# Altium schematic sheet LaserDiode.SchDoc
size B; SheetNumber: 5; SheetTotal: 6
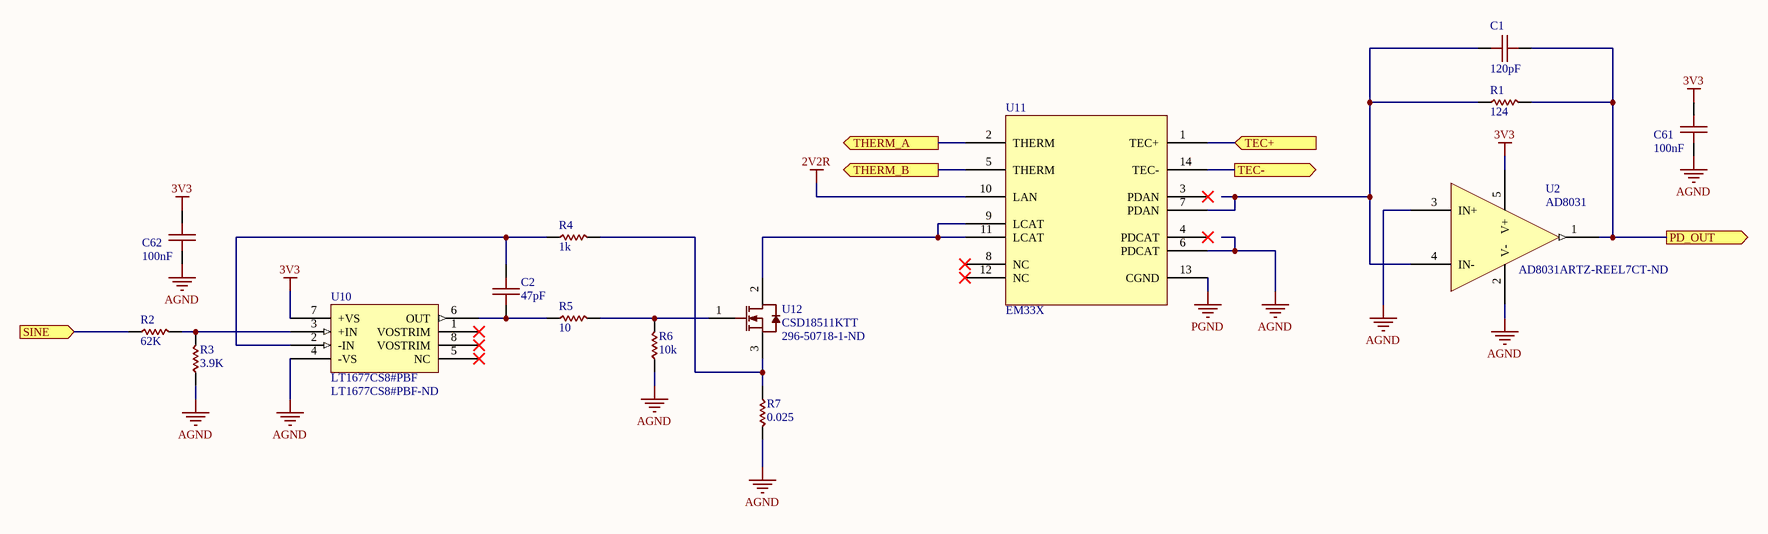
[diagram p0: LaserDiode.SchDoc]

## Parts
C1  120pF  [0603 B]
C2  47pF  [0603 B]
C61  100nF  [0603 B]
C62  100nF  [0603 B]
R1  124  [0805]
R2  62K  [0805]
R3  3.9K  [0805]
R4  1k  [0805]
R5  10  [0805]
R6  10k  [0805]
R7  0.025  [1206]
U2  AD8031  Supplier Part Number 1: AD8031ARTZ-REEL7CT-ND  [TSOT-23-5]
U10  LT1677CS8#PBF  Supplier Part Number 1: LT1677CS8#PBF-ND  [SO-8_S_LIT]
U11  EM33X  [AC1409]
U12  CSD18511KTT  Supplier Part Number 1: 296-50718-1-ND  [DPAK]

## Ports
PD_OUT (out), SINE (in), TEC+ (in), TEC- (out), THERM_A (out), THERM_B (out)

## Nets
2V2R: U11.10(LAN)
3V3: C61.1 C62.1 U2.5(V+) U10.7(+VS)
AGND: C61.2 C62.2 R3.2 R6.2 R7.1 U2.2(V-) U2.3(IN+) U10.4(-VS) U11.6(PDCAT)
PGND: U11.13(CGND)
PD_OUT: C1.1 R1.1 U2.1(OUT) ; port PD_OUT
SINE: R2.2 ; port SINE
TEC+: U11.1(TEC+) ; port TEC+
TEC-: U11.14(TEC-) ; port TEC-
THERM_A: U11.2(THERM) ; port THERM_A
THERM_B: U11.5(THERM) ; port THERM_B
NetC1_2: C1.2 R1.2 U2.4(IN-) U11.7(PDAN)
NetC2_1: C2.1 R4.2 U10.2(-IN)
NetC2_2: C2.2 R5.2 U10.6(OUT)
NetR2_1: R2.1 R3.1 U10.3(+IN)
NetR4_1: R4.1 R7.2 U12.3(S)
NetR5_1: R5.1 R6.1 U12.1(G)
NetU11_9: U11.9(LCAT) U11.11(LCAT) U12.2(D)

Not connected (* = marked no-connect by the designer): U10 1(VOSTRIM)* 5(NC)* 8(VOSTRIM)*; U11 3(PDAN)* 4(PDCAT)* 8(NC)* 12(NC)*

## Library data of the parts
C1 C2 C61 C62 = CAP 0603: 603 Capacitor
  C1: Value: 120pF
  C2: Value: 47pF
  C61 C62: Value: 100nF
R1-R6 = RES 0805: 805 Resistor
  R1: Value: 124
  R2: Value: 62K
  R3: Value: 3.9K
  R4: Value: 1k
  R5: Value: 10
  R6: Value: 10k
R7 = RES 1206: 1206 Resistor; Value: 0.025
U2 = AD8031: 2.7V, 800 uA, 80 MHz Rail-to-Rail I/O Amplifiers; Ref: AD8031; Supplier 1: Digi-Key
U10 = LT1677CS8#PBF: Low Noise, Rail-to-Rail Precision Op Amp; Vendor: Linear Technology; Built_By: EMA_UL_Team; SourceLibrary: LinearTech_2016-05-13_8; Manufacturer_Part_Number: LT1677CS8#PBF; Copyright: Copyright (C) 2018 Accelerated Designs. All rights reserved; RefDes: RefDes; Type: DEV; Supplier 1: Digi-Key
U11 = EM33X: 5W Cooled 9XX Multimode Lasers in 14-Pin Package
U12 = CSD18511KTT: 40-V, N channel NexFET™ power MOSFET, single D2PAK, 2.6 mOhm; Vendor: Texas Instruments; Built_By: EMA_Jessica; SourceLibrary: TI_2019-05-10; Manufacturer_Part_Number: CSD18511KTT; Copyright: Copyright (C) 2018 Accelerated Designs. All rights reserved; RefDes: RefDes; Type: DEV; Supplier 1: Digi-Key